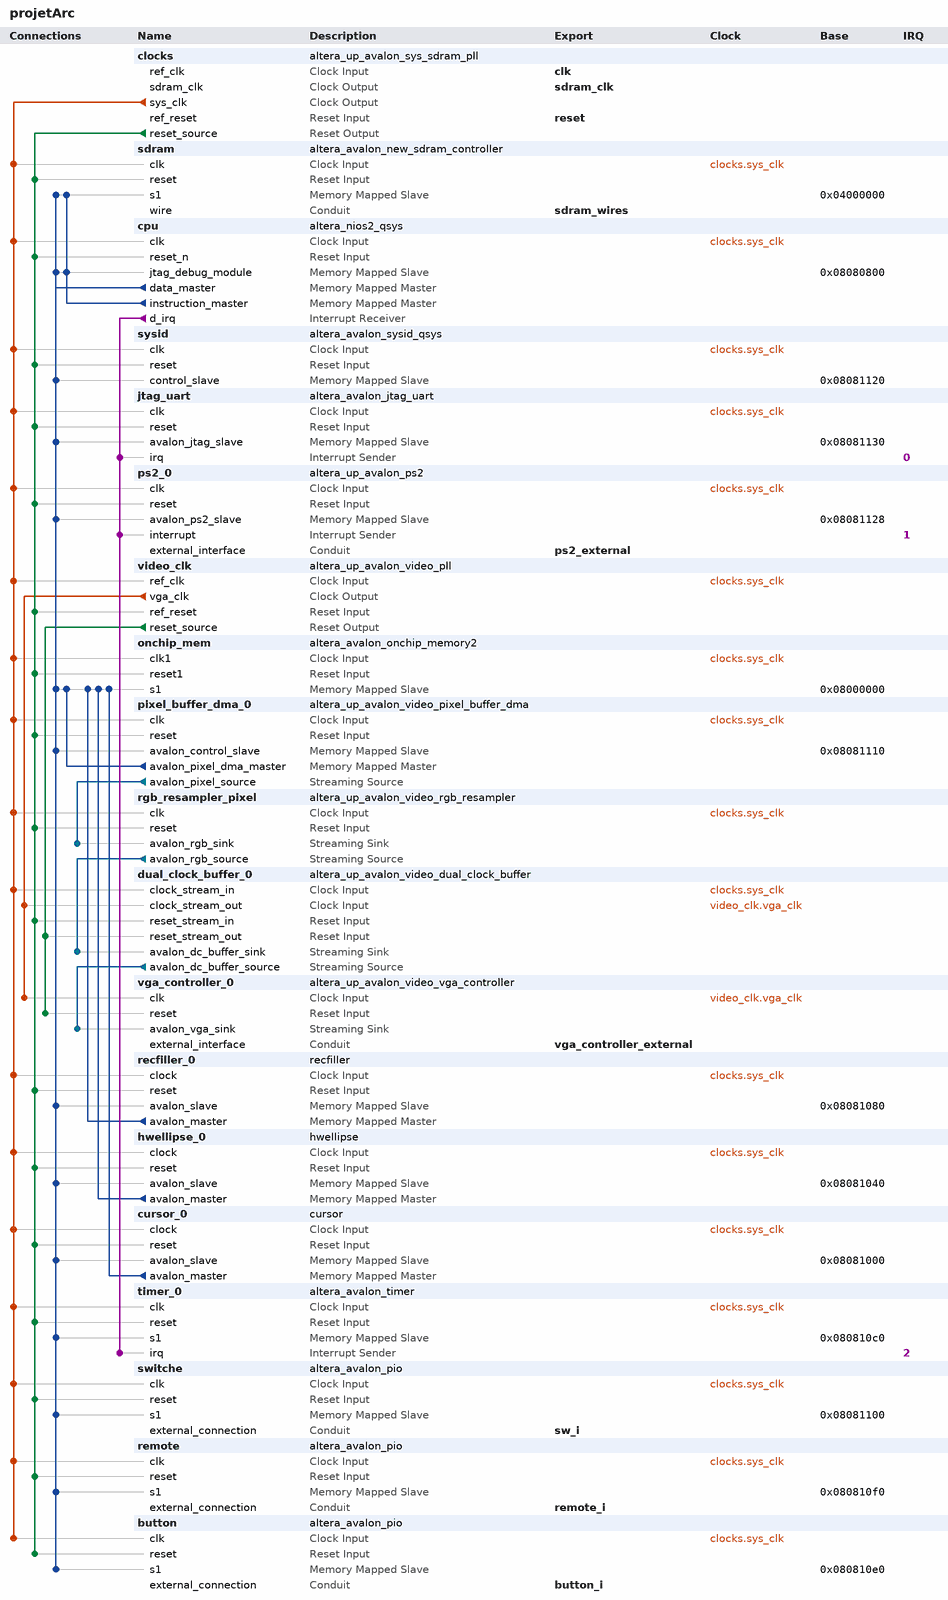
[diagram p0: system contents]
# Platform Designer (Qsys) system projetArc, Cyclone V 5CSEMA5F31C6
# Parameters at their usual value, and those the tool derives, are not listed.
package require -exact qsys 18.1
create_system projetArc
set_project_property DEVICE_FAMILY {Cyclone V}
set_project_property DEVICE 5CSEMA5F31C6

add_instance clocks altera_up_avalon_sys_sdram_pll 18.0
set_instance_parameter_value clocks CV_boards DE1-SoC
set_instance_parameter_value clocks gui_outclk 50.0
set_instance_parameter_value clocks gui_refclk 50.0

add_instance sdram altera_avalon_new_sdram_controller 18.1
set_instance_parameter_value sdram TAC 5.4
set_instance_parameter_value sdram TRCD 15.0
set_instance_parameter_value sdram TRP 15.0
set_instance_parameter_value sdram casLatency 3
set_instance_parameter_value sdram columnWidth 10
set_instance_parameter_value sdram dataWidth 16
set_instance_parameter_value sdram generateSimulationModel false
set_instance_parameter_value sdram model single_Micron_MT48LC4M32B2_7_chip
set_instance_parameter_value sdram numberOfBanks 4
set_instance_parameter_value sdram numberOfChipSelects 1
set_instance_parameter_value sdram powerUpDelay 100.0
set_instance_parameter_value sdram refreshPeriod 7.8125
set_instance_parameter_value sdram rowWidth 13

add_instance cpu altera_nios2_qsys 16.1
set_instance_parameter_value cpu breakSlave cpu.jtag_debug_module
set_instance_parameter_value cpu exceptionSlave sdram.s1
set_instance_parameter_value cpu icache_size 4096
set_instance_parameter_value cpu impl Fast
set_instance_parameter_value cpu mmu_TLBMissExcSlave None
set_instance_parameter_value cpu muldiv_divider true
set_instance_parameter_value cpu resetSlave sdram.s1
set_instance_parameter_value cpu resetrequest_enabled true

add_instance sysid altera_avalon_sysid_qsys 18.1
set_instance_parameter_value sysid id -559038801

add_instance jtag_uart altera_avalon_jtag_uart 18.1
set_instance_parameter_value jtag_uart simInteractiveOptions NO_INTERACTIVE_WINDOWS

add_instance ps2_0 altera_up_avalon_ps2 18.0

add_instance video_clk altera_up_avalon_video_pll 18.0
set_instance_parameter_value video_clk camera {5MP Digital Camera (THDB_D5M)}
set_instance_parameter_value video_clk gui_refclk 50.0
set_instance_parameter_value video_clk lcd {7" LCD on VEEK-MT and MTL/MTL2 Modules}

add_instance onchip_mem altera_avalon_onchip_memory2 18.1
set_instance_parameter_value onchip_mem dataWidth 32
set_instance_parameter_value onchip_mem dualPort false
set_instance_parameter_value onchip_mem initMemContent true
set_instance_parameter_value onchip_mem initializationFileName onchip_mem.hex
set_instance_parameter_value onchip_mem memorySize 307200

add_instance pixel_buffer_dma_0 altera_up_avalon_video_pixel_buffer_dma 18.0
set_instance_parameter_value pixel_buffer_dma_0 addr_mode Consecutive
set_instance_parameter_value pixel_buffer_dma_0 back_start_address 134217728
set_instance_parameter_value pixel_buffer_dma_0 color_space {8-bit RGB}
set_instance_parameter_value pixel_buffer_dma_0 image_height 480
set_instance_parameter_value pixel_buffer_dma_0 image_width 640
set_instance_parameter_value pixel_buffer_dma_0 start_address 134217728

add_instance rgb_resampler_pixel altera_up_avalon_video_rgb_resampler 18.0
set_instance_parameter_value rgb_resampler_pixel alpha 1023
set_instance_parameter_value rgb_resampler_pixel input_type {8-bit RGB}
set_instance_parameter_value rgb_resampler_pixel output_type {30-bit RGB}

add_instance dual_clock_buffer_0 altera_up_avalon_video_dual_clock_buffer 18.0
set_instance_parameter_value dual_clock_buffer_0 color_bits 10

add_instance vga_controller_0 altera_up_avalon_video_vga_controller 18.0
set_instance_parameter_value vga_controller_0 board DE1-SoC
set_instance_parameter_value vga_controller_0 resolution {VGA 640x480}

add_instance recfiller_0 recfiller 1.0

add_instance hwellipse_0 hwellipse 1.0

add_instance cursor_0 cursor 1.2

add_instance timer_0 altera_avalon_timer 18.1
set_instance_parameter_value timer_0 period 1
set_instance_parameter_value timer_0 periodUnits MSEC

add_instance switche altera_avalon_pio 18.1
set_instance_parameter_value switche direction Input
set_instance_parameter_value switche width 1

add_instance remote altera_avalon_pio 18.1
set_instance_parameter_value remote direction Input
set_instance_parameter_value remote edgeType FALLING
set_instance_parameter_value remote width 6

add_instance button altera_avalon_pio 18.1
set_instance_parameter_value button direction Input
set_instance_parameter_value button width 1

# connections
add_connection clocks.sys_clk button.clk clock
add_connection clocks.sys_clk cpu.clk clock
add_connection clocks.sys_clk cursor_0.clock clock
add_connection clocks.sys_clk dual_clock_buffer_0.clock_stream_in clock
add_connection clocks.sys_clk hwellipse_0.clock clock
add_connection clocks.sys_clk jtag_uart.clk clock
add_connection clocks.sys_clk onchip_mem.clk1 clock
add_connection clocks.sys_clk pixel_buffer_dma_0.clk clock
add_connection clocks.sys_clk ps2_0.clk clock
add_connection clocks.sys_clk recfiller_0.clock clock
add_connection clocks.sys_clk remote.clk clock
add_connection clocks.sys_clk rgb_resampler_pixel.clk clock
add_connection clocks.sys_clk sdram.clk clock
add_connection clocks.sys_clk switche.clk clock
add_connection clocks.sys_clk sysid.clk clock
add_connection clocks.sys_clk timer_0.clk clock
add_connection clocks.sys_clk video_clk.ref_clk clock
add_connection video_clk.vga_clk dual_clock_buffer_0.clock_stream_out clock
add_connection video_clk.vga_clk vga_controller_0.clk clock
add_connection clocks.reset_source button.reset reset
add_connection clocks.reset_source cpu.reset_n reset
add_connection clocks.reset_source cursor_0.reset reset
add_connection clocks.reset_source dual_clock_buffer_0.reset_stream_in reset
add_connection clocks.reset_source hwellipse_0.reset reset
add_connection clocks.reset_source jtag_uart.reset reset
add_connection clocks.reset_source onchip_mem.reset1 reset
add_connection clocks.reset_source pixel_buffer_dma_0.reset reset
add_connection clocks.reset_source ps2_0.reset reset
add_connection clocks.reset_source recfiller_0.reset reset
add_connection clocks.reset_source remote.reset reset
add_connection clocks.reset_source rgb_resampler_pixel.reset reset
add_connection clocks.reset_source sdram.reset reset
add_connection clocks.reset_source switche.reset reset
add_connection clocks.reset_source sysid.reset reset
add_connection clocks.reset_source timer_0.reset reset
add_connection clocks.reset_source video_clk.ref_reset reset
add_connection video_clk.reset_source dual_clock_buffer_0.reset_stream_out reset
add_connection video_clk.reset_source vga_controller_0.reset reset
add_connection cpu.data_master button.s1 avalon
set_connection_parameter_value cpu.data_master/button.s1 baseAddress 0x080810e0
add_connection cpu.data_master cpu.jtag_debug_module avalon
set_connection_parameter_value cpu.data_master/cpu.jtag_debug_module baseAddress 0x08080800
add_connection cpu.data_master cursor_0.avalon_slave avalon
set_connection_parameter_value cpu.data_master/cursor_0.avalon_slave baseAddress 0x08081000
add_connection cpu.data_master hwellipse_0.avalon_slave avalon
set_connection_parameter_value cpu.data_master/hwellipse_0.avalon_slave baseAddress 0x08081040
add_connection cpu.data_master jtag_uart.avalon_jtag_slave avalon
set_connection_parameter_value cpu.data_master/jtag_uart.avalon_jtag_slave baseAddress 0x08081130
add_connection cpu.data_master onchip_mem.s1 avalon
set_connection_parameter_value cpu.data_master/onchip_mem.s1 baseAddress 0x08000000
add_connection cpu.data_master pixel_buffer_dma_0.avalon_control_slave avalon
set_connection_parameter_value cpu.data_master/pixel_buffer_dma_0.avalon_control_slave baseAddress 0x08081110
add_connection cpu.data_master ps2_0.avalon_ps2_slave avalon
set_connection_parameter_value cpu.data_master/ps2_0.avalon_ps2_slave baseAddress 0x08081128
add_connection cpu.data_master recfiller_0.avalon_slave avalon
set_connection_parameter_value cpu.data_master/recfiller_0.avalon_slave baseAddress 0x08081080
add_connection cpu.data_master remote.s1 avalon
set_connection_parameter_value cpu.data_master/remote.s1 baseAddress 0x080810f0
add_connection cpu.data_master sdram.s1 avalon
set_connection_parameter_value cpu.data_master/sdram.s1 baseAddress 0x04000000
add_connection cpu.data_master switche.s1 avalon
set_connection_parameter_value cpu.data_master/switche.s1 baseAddress 0x08081100
add_connection cpu.data_master sysid.control_slave avalon
set_connection_parameter_value cpu.data_master/sysid.control_slave baseAddress 0x08081120
add_connection cpu.data_master timer_0.s1 avalon
set_connection_parameter_value cpu.data_master/timer_0.s1 baseAddress 0x080810c0
add_connection cpu.instruction_master cpu.jtag_debug_module avalon
set_connection_parameter_value cpu.instruction_master/cpu.jtag_debug_module baseAddress 0x08080800
add_connection cpu.instruction_master sdram.s1 avalon
set_connection_parameter_value cpu.instruction_master/sdram.s1 baseAddress 0x04000000
add_connection cursor_0.avalon_master onchip_mem.s1 avalon
set_connection_parameter_value cursor_0.avalon_master/onchip_mem.s1 baseAddress 0x08000000
add_connection hwellipse_0.avalon_master onchip_mem.s1 avalon
set_connection_parameter_value hwellipse_0.avalon_master/onchip_mem.s1 baseAddress 0x08000000
add_connection pixel_buffer_dma_0.avalon_pixel_dma_master onchip_mem.s1 avalon
set_connection_parameter_value pixel_buffer_dma_0.avalon_pixel_dma_master/onchip_mem.s1 baseAddress 0x08000000
add_connection recfiller_0.avalon_master onchip_mem.s1 avalon
set_connection_parameter_value recfiller_0.avalon_master/onchip_mem.s1 baseAddress 0x08000000
add_connection dual_clock_buffer_0.avalon_dc_buffer_source vga_controller_0.avalon_vga_sink avalon_streaming
add_connection pixel_buffer_dma_0.avalon_pixel_source rgb_resampler_pixel.avalon_rgb_sink avalon_streaming
add_connection rgb_resampler_pixel.avalon_rgb_source dual_clock_buffer_0.avalon_dc_buffer_sink avalon_streaming
add_connection cpu.d_irq jtag_uart.irq interrupt
set_connection_parameter_value cpu.d_irq/jtag_uart.irq irqNumber 0
add_connection cpu.d_irq ps2_0.interrupt interrupt
set_connection_parameter_value cpu.d_irq/ps2_0.interrupt irqNumber 1
add_connection cpu.d_irq timer_0.irq interrupt
set_connection_parameter_value cpu.d_irq/timer_0.irq irqNumber 2

# exported interfaces
add_interface button_i conduit end
set_interface_property button_i EXPORT_OF button.external_connection
add_interface clk clock sink
set_interface_property clk EXPORT_OF clocks.ref_clk
add_interface ps2_external conduit end
set_interface_property ps2_external EXPORT_OF ps2_0.external_interface
add_interface remote_i conduit end
set_interface_property remote_i EXPORT_OF remote.external_connection
add_interface reset reset sink
set_interface_property reset EXPORT_OF clocks.ref_reset
add_interface sdram_clk clock source
set_interface_property sdram_clk EXPORT_OF clocks.sdram_clk
add_interface sdram_wires conduit end
set_interface_property sdram_wires EXPORT_OF sdram.wire
add_interface sw_i conduit end
set_interface_property sw_i EXPORT_OF switche.external_connection
add_interface vga_controller_external conduit end
set_interface_property vga_controller_external EXPORT_OF vga_controller_0.external_interface

set_interconnect_requirement {$system} qsys_mm.clockCrossingAdapter HANDSHAKE
set_interconnect_requirement {$system} qsys_mm.enableEccProtection FALSE
set_interconnect_requirement {$system} qsys_mm.insertDefaultSlave FALSE
set_interconnect_requirement {$system} qsys_mm.maxAdditionalLatency 1

save_system projetArc.qsys
